# Altium schematic sheet 202004A830.SchDoc
size A4
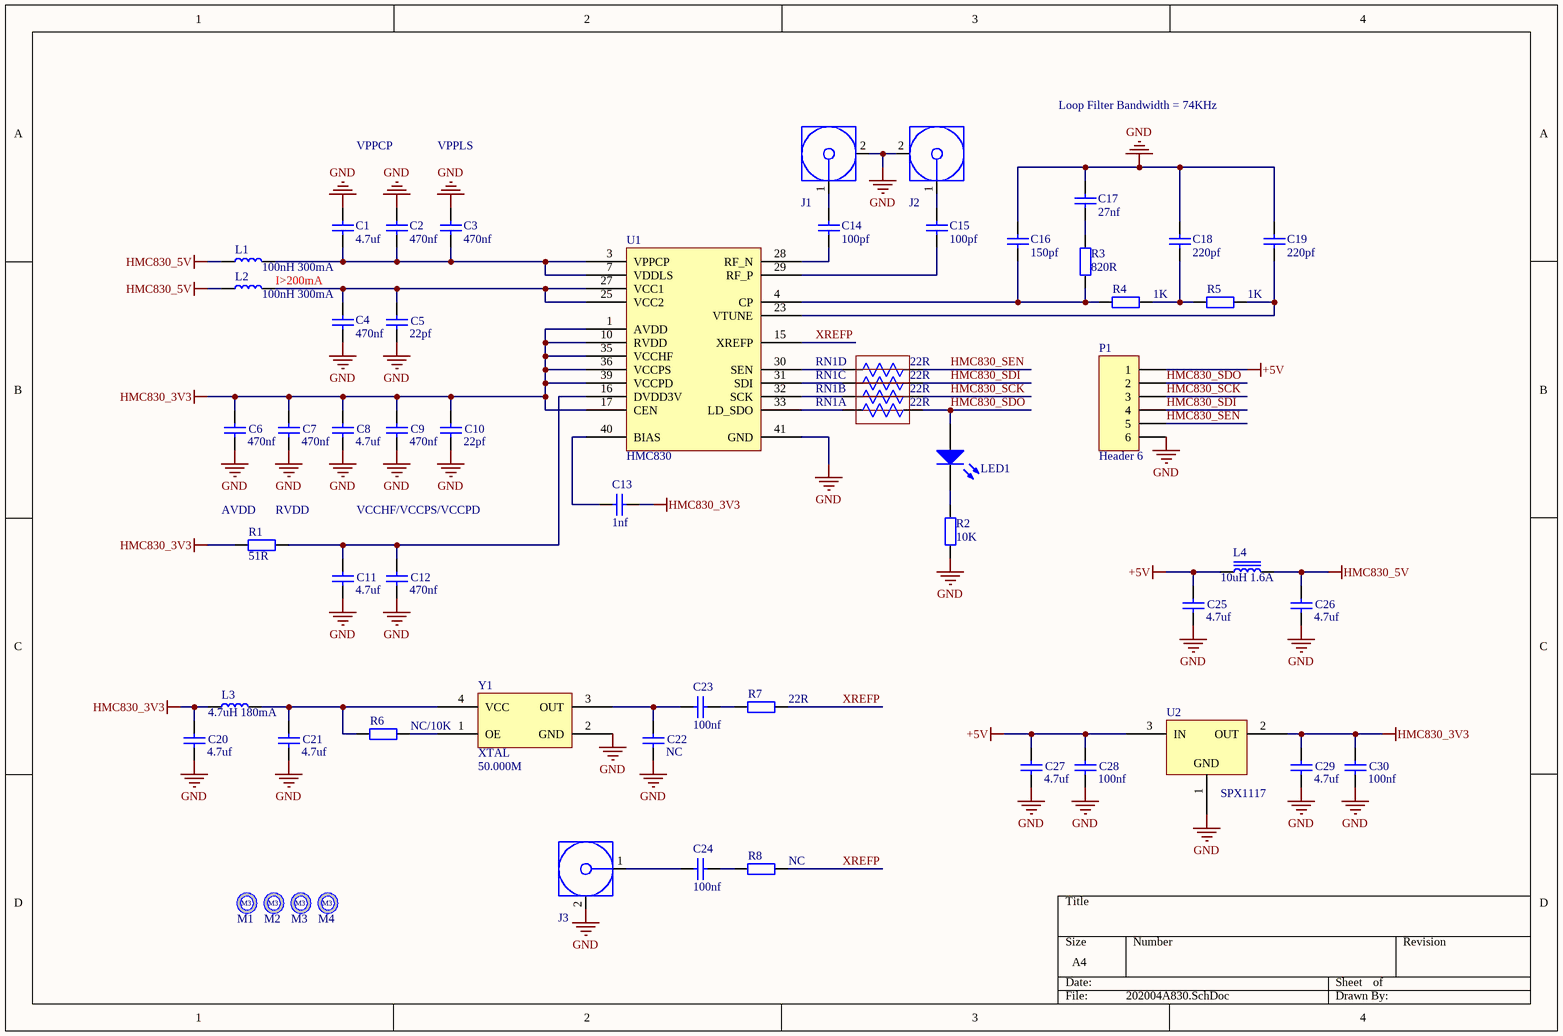
[diagram p0: 202004A830.SchDoc]

## Parts
C1  value 4.7uf  [C0805]  (hidden comment: Cap)
C2  value 470nf  [C0805]  (hidden comment: Cap)
C3  value 470nf  [C0805]  (hidden comment: Cap)
C4  value 470nf  [C0805]  (hidden comment: Cap)
C5  value 22pf  [C0805]  (hidden comment: Cap)
C6  value 470nf  [C0805]  (hidden comment: Cap)
C7  value 470nf  [C0805]  (hidden comment: Cap)
C8  value 4.7uf  [C0805]  (hidden comment: Cap)
C9  value 470nf  [C0805]  (hidden comment: Cap)
C10  value 22pf  [C0805]  (hidden comment: Cap)
C11  value 4.7uf  [C0805]  (hidden comment: Cap)
C12  value 470nf  [C0805]  (hidden comment: Cap)
C13  value 1nf  [C0805]  (hidden comment: Cap)
C14  value 100pf  [C0805]  (hidden comment: Cap)
C15  value 100pf  [C0805]  (hidden comment: Cap)
C16  value 150pf  [C0805]  (hidden comment: Cap)
C17  value 27nf  [C0805]  (hidden comment: Cap)
C18  value 220pf  [C0805]  (hidden comment: Cap)
C19  value 220pf  [C0805]  (hidden comment: Cap)
C20  value 4.7uf  [C0805]  (hidden comment: Cap)
C21  value 4.7uf  [C0805]  (hidden comment: Cap)
C22  value NC  [C0805]  (hidden comment: Cap)
C23  value 100nf  [C0805]  (hidden comment: Cap)
C24  value 100nf  [C0805]  (hidden comment: Cap)
C25  value 4.7uf  [C0805]  (hidden comment: Cap)
C26  value 4.7uf  [C0805]  (hidden comment: Cap)
C27  value 4.7uf  [C0805]  (hidden comment: Cap)
C28  value 100nf  [C0805]  (hidden comment: Cap)
C29  value 4.7uf  [C0805]  (hidden comment: Cap)
C30  value 100nf  [C0805]  (hidden comment: Cap)
J1  SMA  [SMA-3]  (value not drawn)
J2  SMA  [SMA-3]  (value not drawn)
J3  SMA  [SMA-3]  (value not drawn)
L1  value 100nH 300mA  [L0805HQ]  (hidden comment: Inductor Chip)
L2  value 100nH 300mA  [L0805HQ]  (hidden comment: Inductor Chip)
L3  value 4.7uH 180mA  [L0805HQ]  (hidden comment: Inductor Chip)
L4  value 10uH 1.6A  [L4020]  (hidden comment: Inductor Iron)
LED1  LED  [LED1206]  (value not drawn)
M1  M3  [M3-3.2X5]  (value not drawn)
M2  M3  [M3-3.2X5]  (value not drawn)
M3  M3  [M3-3.2X5]  (value not drawn)
M4  M3  [M3-3.2X5]  (value not drawn)
P1  Header 6  [HDR1X6]
R1  value 51R  [R0805]  (hidden comment: Res)
R2  value 10K  [R0805]  (hidden comment: Res)
R3  value 820R  [R0805]  (hidden comment: Res)
R4  value 1K  [R0805]  (hidden comment: Res)
R5  value 1K  [R0805]  (hidden comment: Res)
R6  value NC/10K  [R0805]  (hidden comment: Res)
R7  value 22R  [R0805]  (hidden comment: Res)
R8  value NC  [R0805]  (hidden comment: Res)
RN1  value 22R  [RA0603]  (hidden comment: Res Array)  (parts A,B,C,D of 4)
U1  HMC830  [HMC830]
U2  SPX1117  [SPX1117-SOT223]
Y1  XTAL  value 50.000M  [XTAL-3225]

## Nets
+5V: C25.2 C27.2 C28.2 L4.1 P1.1 U2.3(IN)
GND: C1.1 C2.1 C3.1 C4.1 C5.1 C6.1 C7.1 C8.1 C9.1 C10.1 C11.1 C12.1 C16.2 C17.2 C18.2 C19.2 C20.1 C21.1 C22.1 C25.1 C26.1 C27.1 C28.1 C29.1 C30.1 J1.2(GND) J2.2(GND) J3.2(GND) P1.6 R2.1 U1.41(GND) U2.1(GND) Y1.2(GND)
HMC830_3V3: C6.2 C7.2 C8.2 C9.2 C10.2 C13.1 C20.2 C29.2 C30.2 L3.1 R1.1 U1.1(AVDD) U1.10(RVDD) U1.17(CEN) U1.35(VCCHF) U1.36(VCCPS) U1.39(VCCPD) U2.2(OUT)
HMC830_5V: C26.2 L1.1 L2.1 L4.2
HMC830_SCK: P1.3 RN1.7
HMC830_SDI: P1.4 RN1.6
HMC830_SDO: LED1.1(A) P1.2 RN1.8
HMC830_SEN: P1.5 RN1.5
XREFP: R7.1 R8.1 U1.15(XREFP)
NetC1_2: C1.2 C2.2 C3.2 L1.2 U1.3(VPPCP) U1.7(VDDLS)
NetC4_2: C4.2 C5.2 L2.2 U1.25(VCC2) U1.27(VCC1)
NetC11_2: C11.2 C12.2 R1.2 U1.16(DVDD3V)
NetC13_2: C13.2 U1.40(BIAS)
NetC14_1: C14.1 J1.1(Signal)
NetC14_2: C14.2 U1.28(RF_N)
NetC15_1: C15.1 J2.1(Signal)
NetC15_2: C15.2 U1.29(RF_P)
NetC16_1: C16.1 R3.2 R4.2 U1.4(CP)
NetC17_1: C17.1 R3.1
NetC18_1: C18.1 R4.1 R5.2
NetC19_1: C19.1 R5.1 U1.23(VTUNE)
NetC21_2: C21.2 L3.2 R6.2 Y1.4(VCC)
NetC22_2: C22.2 C23.2 Y1.3(OUT)
NetC23_1: C23.1 R7.2
NetC24_1: C24.1 R8.2
NetC24_2: C24.2 J3.1(Signal)
NetLED1_2: LED1.2(K) R2.2
NetR6_1: R6.1 Y1.1(OE)
NetRN1_1: RN1.1 U1.33(LD_SDO)
NetRN1_2: RN1.2 U1.32(SCK)
NetRN1_3: RN1.3 U1.31(SDI)
NetRN1_4: RN1.4 U1.30(SEN)

## Notes on the sheet
- Loop Filter Bandwidth = 74KHz
- VPPCP
- VPPLS
- I>200mA
- (near R1) AVDD
- (near R1) RVDD
- VCCHF/VCCPS/VCCPD

## Library data of the parts
L1-L3 = Inductor Chip: Chip Inductor
L4 = Inductor Iron: Magnetic-Core Inductor
P1 = Header 6: Header, 6-Pin; LatestRevisionDate: 17-Jul-2002; LatestRevisionNote: Re-released for DXP Platform.; Publisher: Altium Limited
R1-R8 = Res: 电阻
RN1 = Res Array 2: 贴片排阻
U1 = HMC830: Fractional-N PLL with Integrated VCO, 25 - 3000 MHz
U2 = SPX1117: 800mA Low Dropout Voltage Regulator
Y1 = XTAL2: 有源晶振